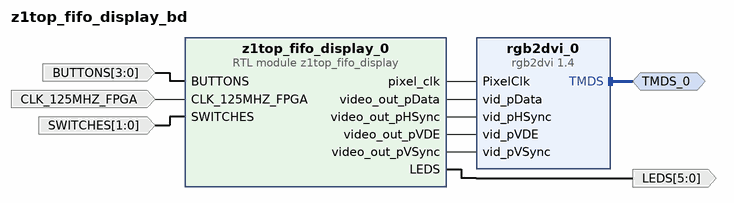
[diagram p0: block diagram of the top level]
# Vivado block design z1top_fifo_display_bd, xc7z020clg400-1, Vivado 2019.1
create_bd_design z1top_fifo_display_bd

create_bd_intf_port -mode Master -vlnv digilentinc.com:interface:tmds_rtl:1.0 TMDS_0
create_bd_port -dir I -from 3 -to 0 BUTTONS
create_bd_port -dir I CLK_125MHZ_FPGA
create_bd_port -dir O -from 5 -to 0 LEDS
create_bd_port -dir I -from 1 -to 0 SWITCHES

create_bd_cell -type ip -vlnv digilentinc.com:ip:rgb2dvi:1.4 rgb2dvi_0
set_property -dict {CONFIG.kClkRange 3} [get_bd_cells rgb2dvi_0]
create_bd_cell -type module -reference z1top_fifo_display z1top_fifo_display_0

# ---- connections ----

connect_bd_intf_net [get_bd_intf_ports TMDS_0] [get_bd_intf_pins rgb2dvi_0/TMDS]
connect_bd_net [get_bd_ports BUTTONS] [get_bd_pins z1top_fifo_display_0/BUTTONS]
connect_bd_net [get_bd_ports CLK_125MHZ_FPGA] [get_bd_pins z1top_fifo_display_0/CLK_125MHZ_FPGA]
connect_bd_net [get_bd_ports SWITCHES] [get_bd_pins z1top_fifo_display_0/SWITCHES]
connect_bd_net [get_bd_pins z1top_fifo_display_0/LEDS] [get_bd_ports LEDS]
connect_bd_net [get_bd_pins z1top_fifo_display_0/pixel_clk] [get_bd_pins rgb2dvi_0/PixelClk]
connect_bd_net [get_bd_pins z1top_fifo_display_0/video_out_pData] [get_bd_pins rgb2dvi_0/vid_pData]
connect_bd_net [get_bd_pins z1top_fifo_display_0/video_out_pHSync] [get_bd_pins rgb2dvi_0/vid_pHSync]
connect_bd_net [get_bd_pins z1top_fifo_display_0/video_out_pVDE] [get_bd_pins rgb2dvi_0/vid_pVDE]
connect_bd_net [get_bd_pins z1top_fifo_display_0/video_out_pVSync] [get_bd_pins rgb2dvi_0/vid_pVSync]

validate_bd_design
save_bd_design
